# EAGLE design pnode (EAGLE 7.3.0)
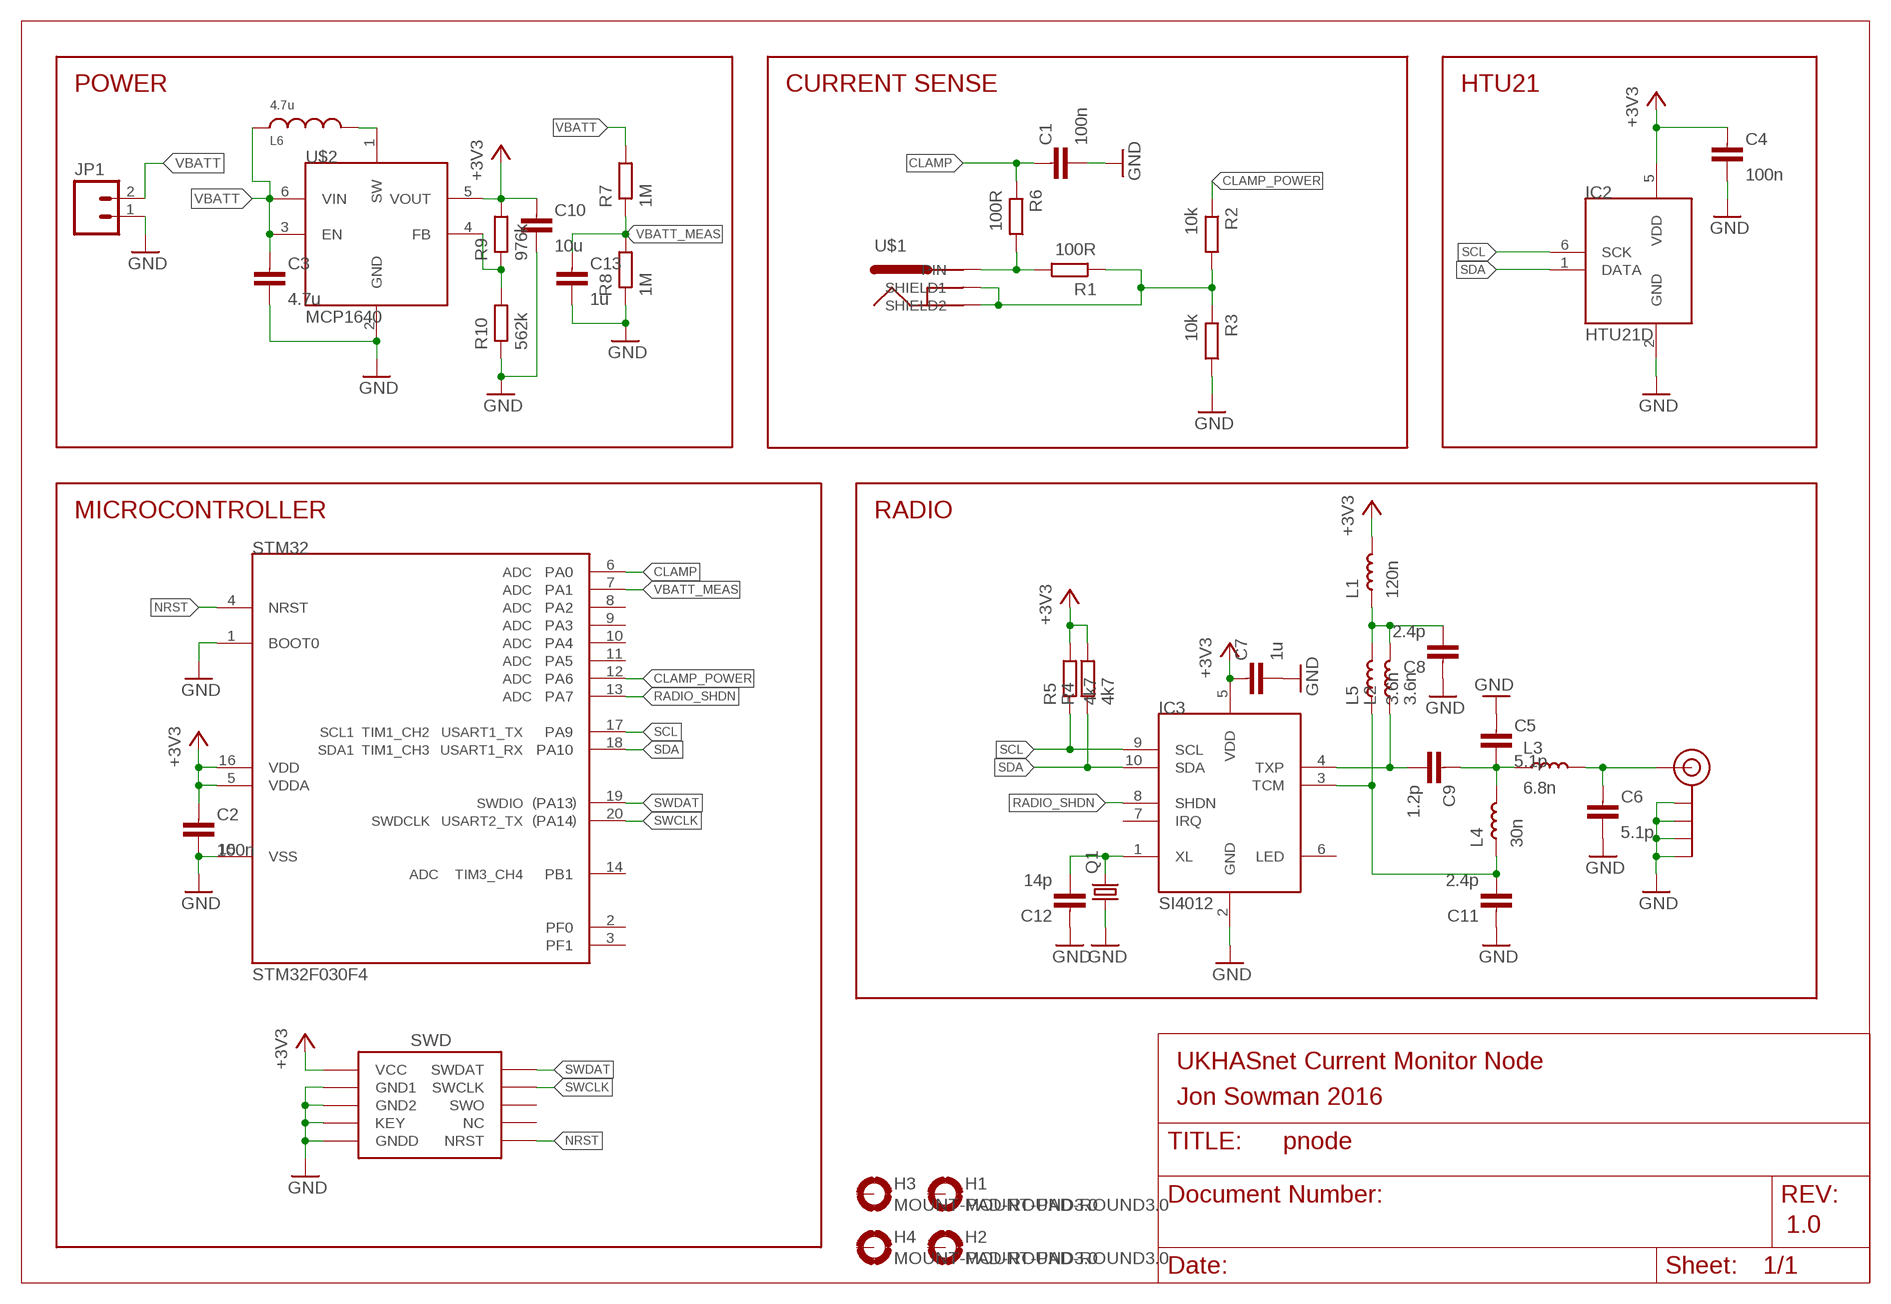
[diagram p0: schematic, sheet 1]

## Parts
C1  100n  CAPACITOR0603-N  [C0603-N]
C2  100n  CAPACITOR0603-N  [C0603-N]
C3  4.7u  CAPACITOR0603-N  [C0603-N]
C4  100n  CAPACITOR0603-N  [C0603-N]
C5  5.1p  CAPACITOR0603-N  [C0603-N]
C6  5.1p  CAPACITOR0603-N  [C0603-N]
C7  1u  CAPACITOR0603-N  [C0603-N]
C8  2.4p  CAPACITOR0603-N  [C0603-N]
C9  1.2p  CAPACITOR0603-N  [C0603-N]
C10  10u  CAPACITOR0603-N  [C0603-N]
C11  2.4p  CAPACITOR0603-N  [C0603-N]
C12  14p  CAPACITOR0603-N  [C0603-N]
C13  1u  CAPACITOR0603-N  [C0603-N]
H1  MOUNT-PAD-ROUND3.0  [3,0-PAD]
H2  MOUNT-PAD-ROUND3.0  [3,0-PAD]
H3  MOUNT-PAD-ROUND3.0  [3,0-PAD]
H4  MOUNT-PAD-ROUND3.0  [3,0-PAD]
IC2  HTU21D  [DFN6-L]
IC3  SI4012  [MSOP10]
J1  SWD_SHROUD_SMD  [SWD_SMD_SHROUD]
J$1  SMA_EDGE  [SMA-EDGE]
JP1  M02PTH  [1X02]
L1  120n  INDUCTOR0603-N  [L0603-N]
L2  3.6n  INDUCTOR0402-N  [L0402-N]
L3  6.8n  INDUCTOR0402-N  [L0402-N]
L4  30n  INDUCTOR0402-N  [L0402-N]
L5  3.6n  INDUCTOR0402-N  [L0402-N]
L6  4.7u  BOURNS_SDE0403A  [BOURNS_SDE0403A]
Q1  CRYSTALHC49S  [HC49/S]
R1  100R  RESISTOR0603-N  [R0603-N]
R2  10k  RESISTOR0603-N  [R0603-N]
R3  10k  RESISTOR0603-N  [R0603-N]
R4  4k7  RESISTOR0603-N  [R0603-N]
R5  4k7  RESISTOR0603-N  [R0603-N]
R6  100R  RESISTOR0603-N  [R0603-N]
R7  1M  RESISTOR0603-N  [R0603-N]
R8  1M  RESISTOR0603-N  [R0603-N]
R9  976k  RESISTOR0603-N  [R0603-N]
R10  562k  RESISTOR0603-N  [R0603-N]
STM32  STM32F030F4  [TSSOP20]
U$1  13MM_DC_JACKPTH  [13MM_DC_JACK]
U$2  MCP1640  [SOT23-6]

## Nets
+3V3: C2.1 C4.1 C7.1 C10.1 IC2.5(VDD) IC3.5(VDD) J1.1(VCC) L1.2 R4.2 R5.2 R9.2 STM32.5(VDDA) STM32.16(VDD) U$2.5(VOUT)
CLAMP: C1.1 R6.1 STM32.6(PA0)
CLAMP_POWER: R2.1 STM32.12(PA6)
GND: C1.2 C2.2 C3.2 C4.2 C5.1 C6.2 C7.2 C8.1 C10.2 C11.1 C12.1 C13.2 IC2.2(GND) IC3.2(GND) J1.3(GND1) J1.5(GND2) J1.7(KEY) J1.9(GNDD) J$1.GND@0(GND) J$1.GND@1(GND) J$1.GND@2(GND) J$1.GND@3(GND) JP1.1 Q1.1 R3.2 R8.1 R10.1 STM32.1(BOOT0) STM32.15(VSS) U$2.2(GND)
N$1: R1.2 R6.2 U$1.1(PIN)
N$2: R1.1 R2.2 R3.1 U$1.2(SHIELD1) U$1.3(SHIELD2)
N$3: R9.1 R10.2 U$2.4(FB)
N$4: C8.2 L1.1 L2.2 L5.2
N$5: C12.2 IC3.1(XL) Q1.2
N$6: L6.P$2 U$2.1(SW)
N$7: C5.2 C9.1 L3.1 L4.2
N$8: C11.2 IC3.3(TCM) L4.1 L5.1
N$9: C9.2 IC3.4(TXP) L2.1
N$10: C6.1 J$1.SIG(SIGNAL) L3.2
NRST: J1.10(NRST) STM32.4(NRST)
RADIO_SHDN: IC3.8(SHDN) STM32.13(PA7)
SCL: IC2.6(SCK) IC3.9(SCL) R5.1 STM32.17(PA9)
SDA: IC2.1(DATA) IC3.10(SDA) R4.1 STM32.18(PA10)
SWCLK: J1.4(SWCLK) STM32.20(PA14)
SWDAT: J1.2(SWDAT) STM32.19(PA13)
VBATT: C3.1 JP1.2 L6.P$1 R7.2 U$2.3(EN) U$2.6(VIN)
VBATT_MEAS: C13.1 R7.1 R8.2 STM32.7(PA1)
Unconnected: H1.B3,0(MOUNT) H2.B3,0(MOUNT) H3.B3,0(MOUNT) H4.B3,0(MOUNT) IC3.6(LED) IC3.7(IRQ) J1.6(SWO) J1.8(NC) STM32.2(PF0) STM32.3(PF1) STM32.8(PA2) STM32.9(PA3) STM32.10(PA4) STM32.11(PA5) STM32.14(PB1)

## Notes on the sheet
- POWER | CURRENT SENSE | HTU21
- MICROCONTROLLER | RADIO
- UKHASnet Current Monitor Node
- Jon Sowman 2016
- 1.0

## Library data of the parts
C1-C13 = passives-7351:CAPACITOR
H1-H4 = dtb:MOUNT-PAD-ROUND: MOUNTING PAD, round
IC2 = Mine:HTU21D
IC3 = Mine:SI4012
J1 = dtb:SWD_SHROUD
J$1 = jonsowman:SMA_EDGE: SMA Antenna Connector End launch SMA connector. The paste layer has been removed so that the connector can be hand soldered onto the board after reflow.
JP1 = Mine:M02: Header 2 Standard 2-pin 0.1" header. Use with straight break away headers (SKU : PRT-00116), right angle break away headers (PRT-00553), swiss pins (PRT-00743), machine pins (PRT-00117), and female headers (PRT-00115). Molex polarized connector foot print use with SKU : PRT-08233 with associated crimp pins and housings.
L1-L5 = passives-7351:INDUCTOR
L6 = jonsowman:BOURNS_SDE0403A
Q1 = crystal:CRYSTAL: CRYSTAL; OC_FARNELL: 1667008; OC_NEWARK: unknown
R1-R10 = passives-7351:RESISTOR
STM32 = dtb:STM32F030F4
U$1 = jonsowman:13MM_DC_JACK
U$2 = ukhas:MCP1640

## Board
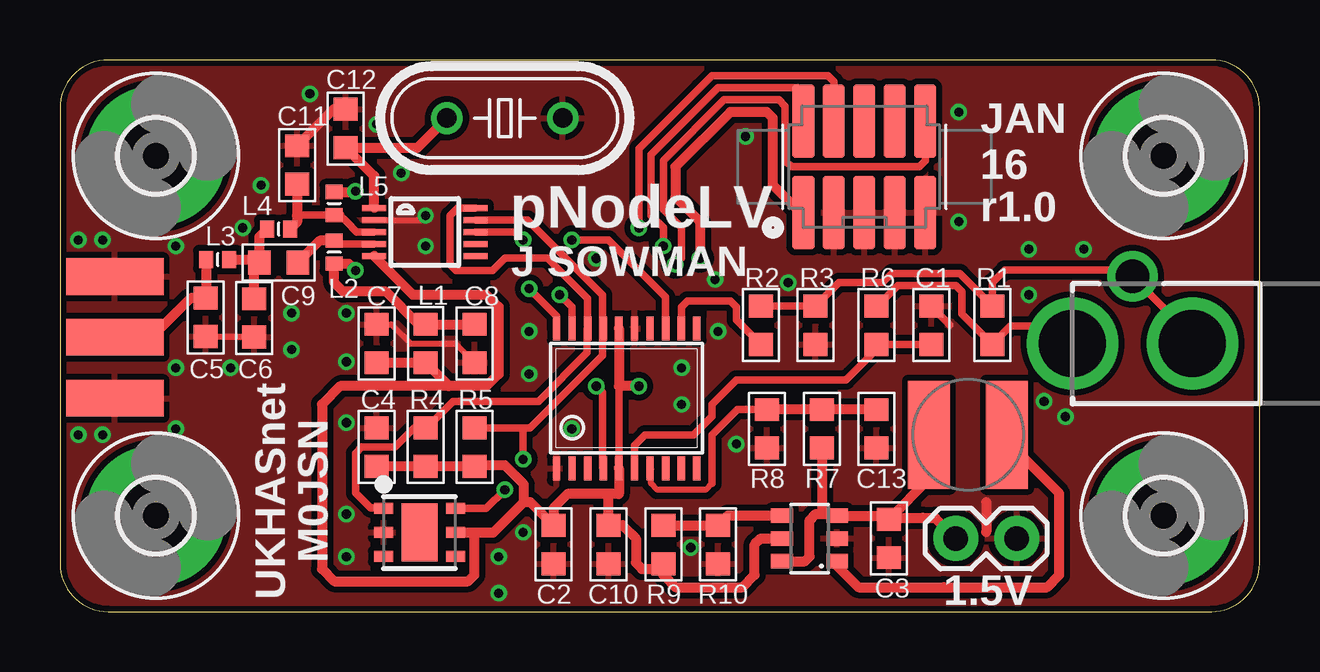
[diagram p1: board, top side]
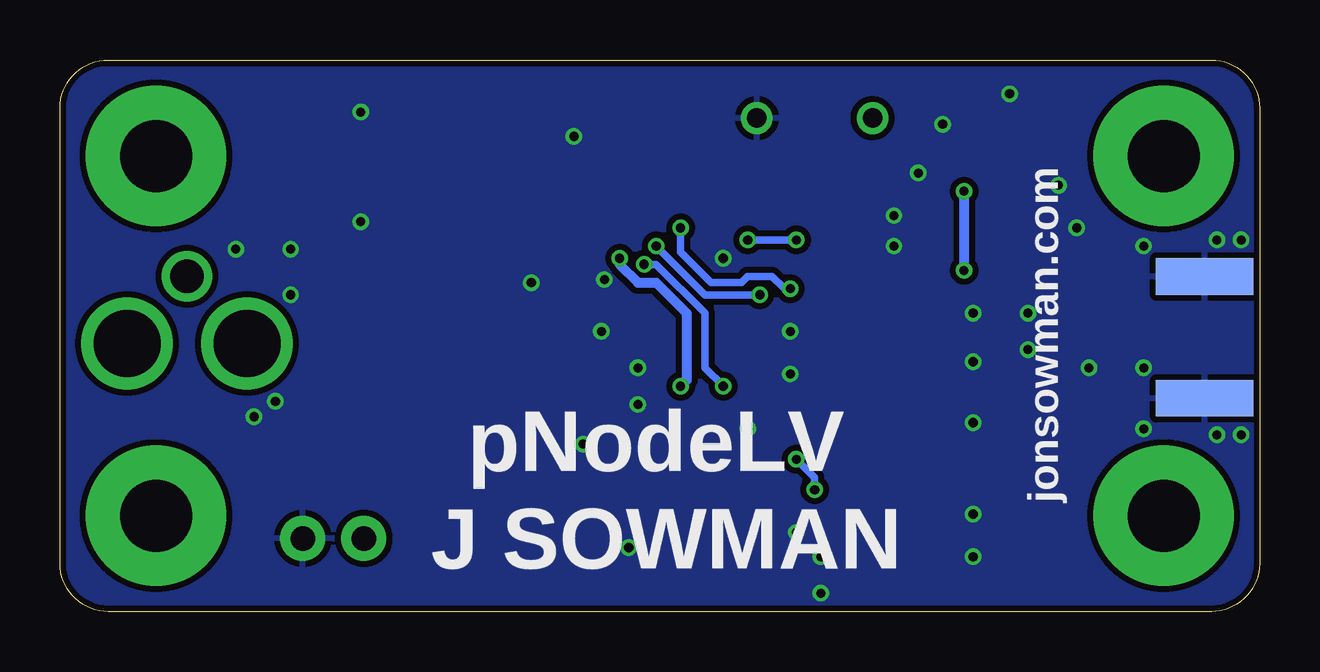
[diagram p2: board, bottom side, seen from below]

Size 50 x 23 mm. Coordinates in mm from the lower left corner, seen from the top.
Outline: 48,23 2,23 arc90 0,21 0,2 arc90 2,0 48,0 arc90 50,2 50,21 arc90 48,23
Copper layers (1*16): Top 0.035mm / dielectric 1.5mm / Bottom 0.035mm
Design rules "dirt_cheap_dirty_boards.v1 *": minimum track width 5mil, minimum drill 12mil, track to track 5mil, track to pad 5mil, pad to pad 5mil, via to via 5mil, smd to smd 0mil, copper to edge 10mil, drill to drill 10mil, minimum pad ring 10mil, minimum via ring 6mil, stop-mask expansion 2mil, vias tented up to drill 25mil, thermal gap 10mil

### Footprints (pad centres in the part's own frame; a part is rotated, then mirrored left to right if it is on the bottom)
C0603-N = smd 0.95 x 1: 1 -0.8,0; 2 0.8,0
3,0-PAD = drill 3 pad 5.842: B3,0 0,0
DFN6-L = smd 0.45 x 0.8: 1 -1,-1.5; 2 0,-1.5; 3 1,-1.5; 4 1,1.5; 5 0,1.5; 6 -1,1.5 | smd 2.4 x 1.5: EP 0,0
MSOP10 = smd 0.25 x 1: 1 -1,-2.113; 2 -0.5,-2.113; 3 0,-2.113; 4 0.5,-2.113; 5 1,-2.113; 6 1,2.113; 7 0.5,2.113; 8 0,2.113; 9 -0.5,2.113; 10 -1,2.113
SWD_SMD_SHROUD = smd 0.914 x 3.048: 1 -2.54,-1.905; 2 -2.54,1.905; 3 -1.27,-1.905; 4 -1.27,1.905; 5 0,-1.905; 6 0,1.905; 7 1.27,-1.905; 8 1.27,1.905; 9 2.54,-1.905; 10 2.54,1.905
SMA-EDGE = smd 1.524 x 4.064: GND@0 0,0; GND@1 5.08,0; SIG 2.54,0 | smd 1.524 x 4.064 bottom: GND@2 0,0; GND@3 5.08,0
1X02 = drill 1.016 pad 1.88: 1 0,0; 2 2.54,0
L0603-N = smd 0.95 x 1: 1 -0.8,0; 2 0.8,0
L0402-N = smd 0.59 x 0.72: 1 -0.48,0; 2 0.48,0
BOURNS_SDE0403A = smd 1.75 x 4.5: P$1 -1.625,0; P$2 1.625,0
HC49/S = drill 0.813: 1 -2.413,0; 2 2.413,0
R0603-N = smd 0.95 x 1: 1 -0.8,0; 2 0.8,0
TSSOP20 = smd 0.305 x 0.991: 1 -2.925,-2.918; 2 -2.275,-2.918; 3 -1.625,-2.918; 4 -0.975,-2.918; 5 -0.325,-2.918; 6 0.325,-2.918; 7 0.975,-2.918; 8 1.625,-2.918; 9 2.275,-2.918; 10 2.925,-2.918; 11 2.925,2.918; 12 2.275,2.918; 13 1.625,2.918; 14 0.975,2.918; 15 0.325,2.918; 16 -0.325,2.918; 17 -0.975,2.918; 18 -1.625,2.918; 19 -2.275,2.918; 20 -2.925,2.918
13MM_DC_JACK = drill 2.8: 1 2.5,0; 2 -2.5,0 | drill 1.4: 3 0,-2.8
SOT23-6 = smd 0.6 x 0.9: 1 -0.95,-1.15; 2 0,-1.15; 3 0.95,-1.15; 4 0.95,1.15; 5 0,1.15; 6 -0.95,1.15

### Placement (x,y rotation side)
C1  36.32,11.94 90 top
C2  20.57,2.79 270 top
C3  34.54,3.05 270 top
C4  13.21,6.86 90 top
C5  8.1,12.24 90 top
C6  6.07,12.27 270 top
C7  13.21,11.18 90 top
C8  17.27,11.18 90 top
C9  9.12,14.55 0 top
C10  22.86,2.79 270 top
C11  9.88,18.62 270 top
C12  11.91,20.14 270 top
C13  34.04,7.62 270 top
H1  46,19 0 top
H2  46,4 0 top
H3  4,4 0 top
H4  4,19 0 top
IC2  14.99,3.3 270 top
IC3  15.21,15.82 270 top
J1  33.53,18.54 0 top
J$1  2.29,8.89 90 top
JP1  39.88,3.05 180 top
L1  15.24,11.18 270 top
L2  11.43,14.99 270 top
L3  6.58,14.68 180 top
L4  9.12,15.95 180 top
L5  11.43,17.02 90 top
L6  37.85,7.37 0 top
Q1  18.54,20.57 180 top
R1  38.86,11.94 270 top
R2  29.21,11.94 90 top
R3  31.5,11.94 270 top
R4  15.24,6.86 270 top
R5  17.27,6.86 270 top
R6  34.04,11.94 90 top
R7  31.75,7.62 270 top
R8  29.46,7.62 90 top
R9  25.15,2.79 270 top
R10  27.43,2.79 90 top
STM32  23.62,8.89 0 top
U$1  44.7,11.18 180 top
U$2  31.24,3.05 90 top

### Tracks (layer width: path | path; a pad name or v marks a point on that pad's centre or on a via)
+3V3  (via drill 0.38)
  Top 0.254: IC3.5 12.86,14.82 | 17.31,6.1 R5.2
  Top 0.305: 23.3,9.4 STM32.5
  Top 0.406: STM32.5 23.3,4.9 22.86,4.9 | R5.2 R4.2 C4.1 | 22.86,4.9 21.15,4.9 20.57,4.32 C2.1 19.6,4.57 19.34,4.57 | C7.1 L1.2 16.22,9.4 | 16.22,9.4 17.78,9.4 18.29,9.91 18.29,12.7 17.78,13.21 14.71,13.21 IC3.5 | 19.34,4.57 19.34,5.3 18.54,6.1 17.31,6.1 | 16.22,9.4 11.68,9.4 10.92,8.64 10.92,1.78 11.43,1.27 17.02,1.27 17.27,1.52 17.27,3.3 | IC2.5 17.27,3.3 | 17.27,3.3 18.07,3.3 19.34,4.57 | STM32.16 23.3,9.4 v24.13,9.4 | 22.86,4.9 C10.1 23.46,3.59 24,3.05 24,2.03 24.26,1.78 25.11,1.78 25.11,1.96 R9.2 25.15,1.52 25.65,1.02 28.45,1.02 28.96,1.52 28.96,2.79 29.21,3.05 U$2.5 | v26.67,14.73 26.67,16.26 25.65,17.27 25.65,18.54 27.94,20.83 29.46,20.83 29.72,20.57 29.72,17.78 30.48,17.02 30.86,16.64 J1.1
  Bottom 0.406: v24.13,9.4 23.88,9.65 23.88,12.45 25.15,13.72 25.4,13.72 25.65,13.72 25.91,13.72 26.67,14.48 v26.67,14.73
CLAMP
  Top 0.305: C1.1 R6.1 34.04,10.92 32.77,9.65 30.99,9.65 28.19,9.65 27.18,8.64 27.18,8.13 26.42,7.37 24.38,7.37 23.95,6.93 STM32.6
CLAMP_POWER
  Top 0.305: STM32.12 25.9,12.69 26.16,12.95 27.94,12.95 28.19,12.7 28.19,12.15 R2.1
GND  (via drill 0.38)
  Top 0.254: C5.1 6.09,11.44 C6.2 | C7.2 13.8,11.98 14.61,11.18 16.47,11.18 C8.1 | IC3.2 15.05,16.32 v15.24,16.51
  Top 0.305: C1.2 36.32,12.7 37.08,11.94
  Top 0.406: C12.1 11.4,20.94 C11.1 | 38.61,4.57 38.61,3.32
  other vias: 4.83,10.16 4.83,7.62 4.83,15.24 0.76,15.49 0.76,7.37 1.78,7.37 1.78,15.49 11.94,7.87 11.94,2.29 11.94,4.06 25.91,10.16 25.91,8.64 19.56,11.68 19.56,9.91 15.24,15.24 9.65,12.45 11.94,12.45 10.41,21.59 8.38,17.78 7.62,16 28.19,6.99 9.65,10.92 7.11,10.16 18.29,2.29 19.3,3.3 18.29,0.76 14.22,18.29 13.21,20.32 41.02,8.76 41.91,8.13 40.39,15.11 42.67,15.11 40.39,13.21 21.34,7.62 11.94,10.41 30.35,13.72 27.43,11.68 22.35,14.73 26.29,2.67 28.57,19.81 27.3,13.84 37.47,20.83 37.47,16.26
  pour Top (isolate 0.254): -0.25,23.37 50.04,23.37 50.04,0 -0.25,0
  pour Bottom (isolate 0.254): 0,22.86 50.29,22.86 50.29,-0.25 0,-0.25
N$1
  Top 0.305: 41.48,11.9 39.88,11.9 39.62,11.9 R1.2 | R6.2 34.07,12.74 34.92,13.59 37.34,13.59 37.59,13.34 37.59,12.41 R1.2 | 38.82,11.18 R1.2
  Top 0.406: 41.48,11.9 U$1.1
N$2
  Top 0.305: R2.2 R3.1 32.47,13.72 34.29,13.72 34.67,14.1 37.5,14.1 R1.1 38.86,13.72 39.38,14.23 40.93,14.23 44.45,14.23 U$1.3 47.2,11.48 U$1.2
N$3
  Top 0.406: U$2.4 28.85,4 27.84,4 R10.2 R9.1
N$4  (via drill 0.38)
  Top 0.305: v12.32,17.53 12.39,17.53 12.42,17.5
  Top 0.406: C8.2 L1.1 14.95,11.98 13.59,13.34 11.81,13.34 11.43,13.72 L2.2 12.04,14.51 v12.32,14.22 | L5.2 12.42,17.5
  Bottom 0.406: v12.32,17.53 v12.32,14.22
N$5
  Top 0.406: IC3.1 13.1,18.16 C12.2 14.9,19.34 Q1.2
N$6
  Top 0.406: U$2.1 32.39,1.9 33.27,1.02 36.83,1.02 41.15,1.02 41.66,1.52 41.66,4.93 39.47,7.11 L6.P$2
N$7
  Top 0.406: L3.1 8.19,14.68 C9.1 | C9.1 8.32,15.63 L4.2 | C5.2 8.1,14.34 C9.1
N$8
  Top 0.305: IC3.3 12.37,15.82 11.94,16.26 11.66,16.54 | L5.1 9.91,16.54 9.88,16.51
  Top 0.406: C11.2 9.88,16.51 9.88,16.23 L4.1 | L5.1 11.66,16.54
N$9
  Top 0.254: 11.57,15.32 L2.1
  Top 0.305: IC3.4 11.57,15.32
  Top 0.406: L2.1 10.83,15.47 C9.2
N$10
  Top 0.406: J$1.SIG 3.81,11.43 5.45,13.07 C6.1 6.1,13.1 L3.2
NRST  (via drill 0.38)
  Top 0.254: 22.61,6.01 STM32.4
  Top 0.305: v22.35,9.4 22.61,9.14 22.61,6.01 | J1.10 36.07,18.8 35.81,18.54 30.48,18.54 30.23,18.8 30.23,21.08 29.97,21.34 27.69,21.34 25.15,18.8 25.15,16.76 25.91,16 25.91,14.73 v25.65,14.48
  Bottom 0.305: v25.65,14.48 25.15,14.48 23.11,12.45 23.11,10.16 v22.35,9.4
RADIO_SHDN  (via drill 0.38)
  Top 0.305: IC3.8 18.97,15.82 v19.3,15.49 | v21.34,15.49 22.86,15.49 25.25,13.11 STM32.13
  Bottom 0.305: v19.3,15.49 v21.34,15.49
SCL  (via drill 0.38)
  Top 0.254: 22.61,11.77 STM32.17 22.61,11.85
  Top 0.305: R5.1 19.3,7.66 | 19.3,7.66 19.6,7.66 22.61,10.67 22.61,11.77 | IC3.9 19.49,16.32 22.61,13.21 22.61,11.85 | IC2.6 17.76,4.3 v18.54,5.08 | v19.3,6.35 19.3,7.66
  Bottom 0.305: v18.54,5.08 18.54,5.59 v19.3,6.35
SDA
  Top 0.254: 21.97,11.78 STM32.18
  Top 0.305: 21.97,11.78 21.97,10.79 19.94,8.76 16.38,8.76 15.28,7.66 R4.1 14.77,7.66 13.97,6.86 12.57,6.86 12.32,6.6 12.32,4.95 12.95,4.32 13.47,4.32 IC2.1 | IC3.10 16.57,16.82 16.26,16.51 16.26,14.48 16.51,14.22 18.03,14.22 18.54,14.73 20.32,14.73 20.83,14.22 22,13.05 STM32.18
SWCLK  (via drill 0.38)
  Top 0.305: STM32.20 20.7,12.32 v19.56,13.46 | v24.13,16 24.13,19.3 26.67,21.84 27.18,22.35 32,22.35 32.26,22.1 J1.4
  Bottom 0.254: v19.56,13.46 19.81,13.46
  Bottom 0.305: 19.81,13.46 20.32,13.97 21.34,13.97 21.59,13.72 22.86,13.72 24.13,14.99 v24.13,16
SWDAT  (via drill 0.38)
  Top 0.305: STM32.19 21.35,12.69 v20.83,13.21 | v25.15,15.24 25.15,16 24.64,16.51 24.64,19.05 26.92,21.34 27.43,21.84 30.73,21.84 30.99,21.59 J1.2
  Bottom 0.305: v20.83,13.21 23.11,13.21 v25.15,15.24
VBATT
  Top 0.406: U$2.6 31.05,2.1 31.24,2.29 31.24,3.81 31.5,4.06 31.75,4.06 | 31.75,4.06 32.33,4.06 U$2.3 34.39,4 C3.1 | C3.1 34.54,3.91 35.97,3.91 36.48,3.91 JP1.2 | R7.2 31.75,4.06 | L6.P$1 36.22,5.53 C3.1
VBATT_MEAS
  Top 0.254: 27.18,5.33 26.92,5.08 24.89,5.08 24.64,5.33 24.64,5.93 STM32.7
  Top 0.305: R8.2 28.23,8.42 27.18,7.37 27.18,5.33
  Top 0.406: C13.1 R7.1 R8.2

### Text on the board
tPlace: pNodeLV | JAN / 16 | r1.0 | J SOWMAN | M0JSN | UKHASnet | 1.5V
bPlace: jonsowman.com | pNodeLV | J SOWMAN